# Altium schematic sheet Sheet_1_2021-12-29.schdoc
size 48 x 43 mm
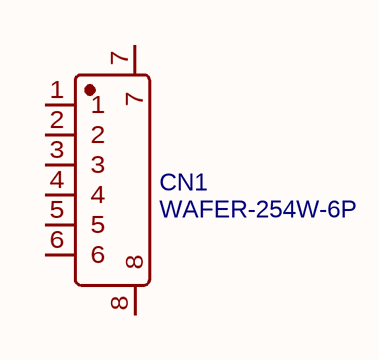
[diagram p0: Sheet_1_2021-12-29.schdoc]

## Parts
CN1  WAFER-254W-6P  [CONN-SMD_WAFER-254W-6P]

## Nets

Not connected (* = marked no-connect by the designer): CN1 1 2 3 4 5 6 7 8

## Library data of the parts
CN1 = WAFER-254W-6P: BOM_Manufacturer: XUNPU(讯普); Contributor: LCSC; BOM_Supplier: LCSC; BOM_Supplier Part: C2856747; BOM_Manufacturer Part: WAFER-254W-6P; spicePre: C; spiceSymbolName: WAFER-254W-6P